# EasyEDA Pro project PCB_Preamp_5.eprj

# Schematic Preamp
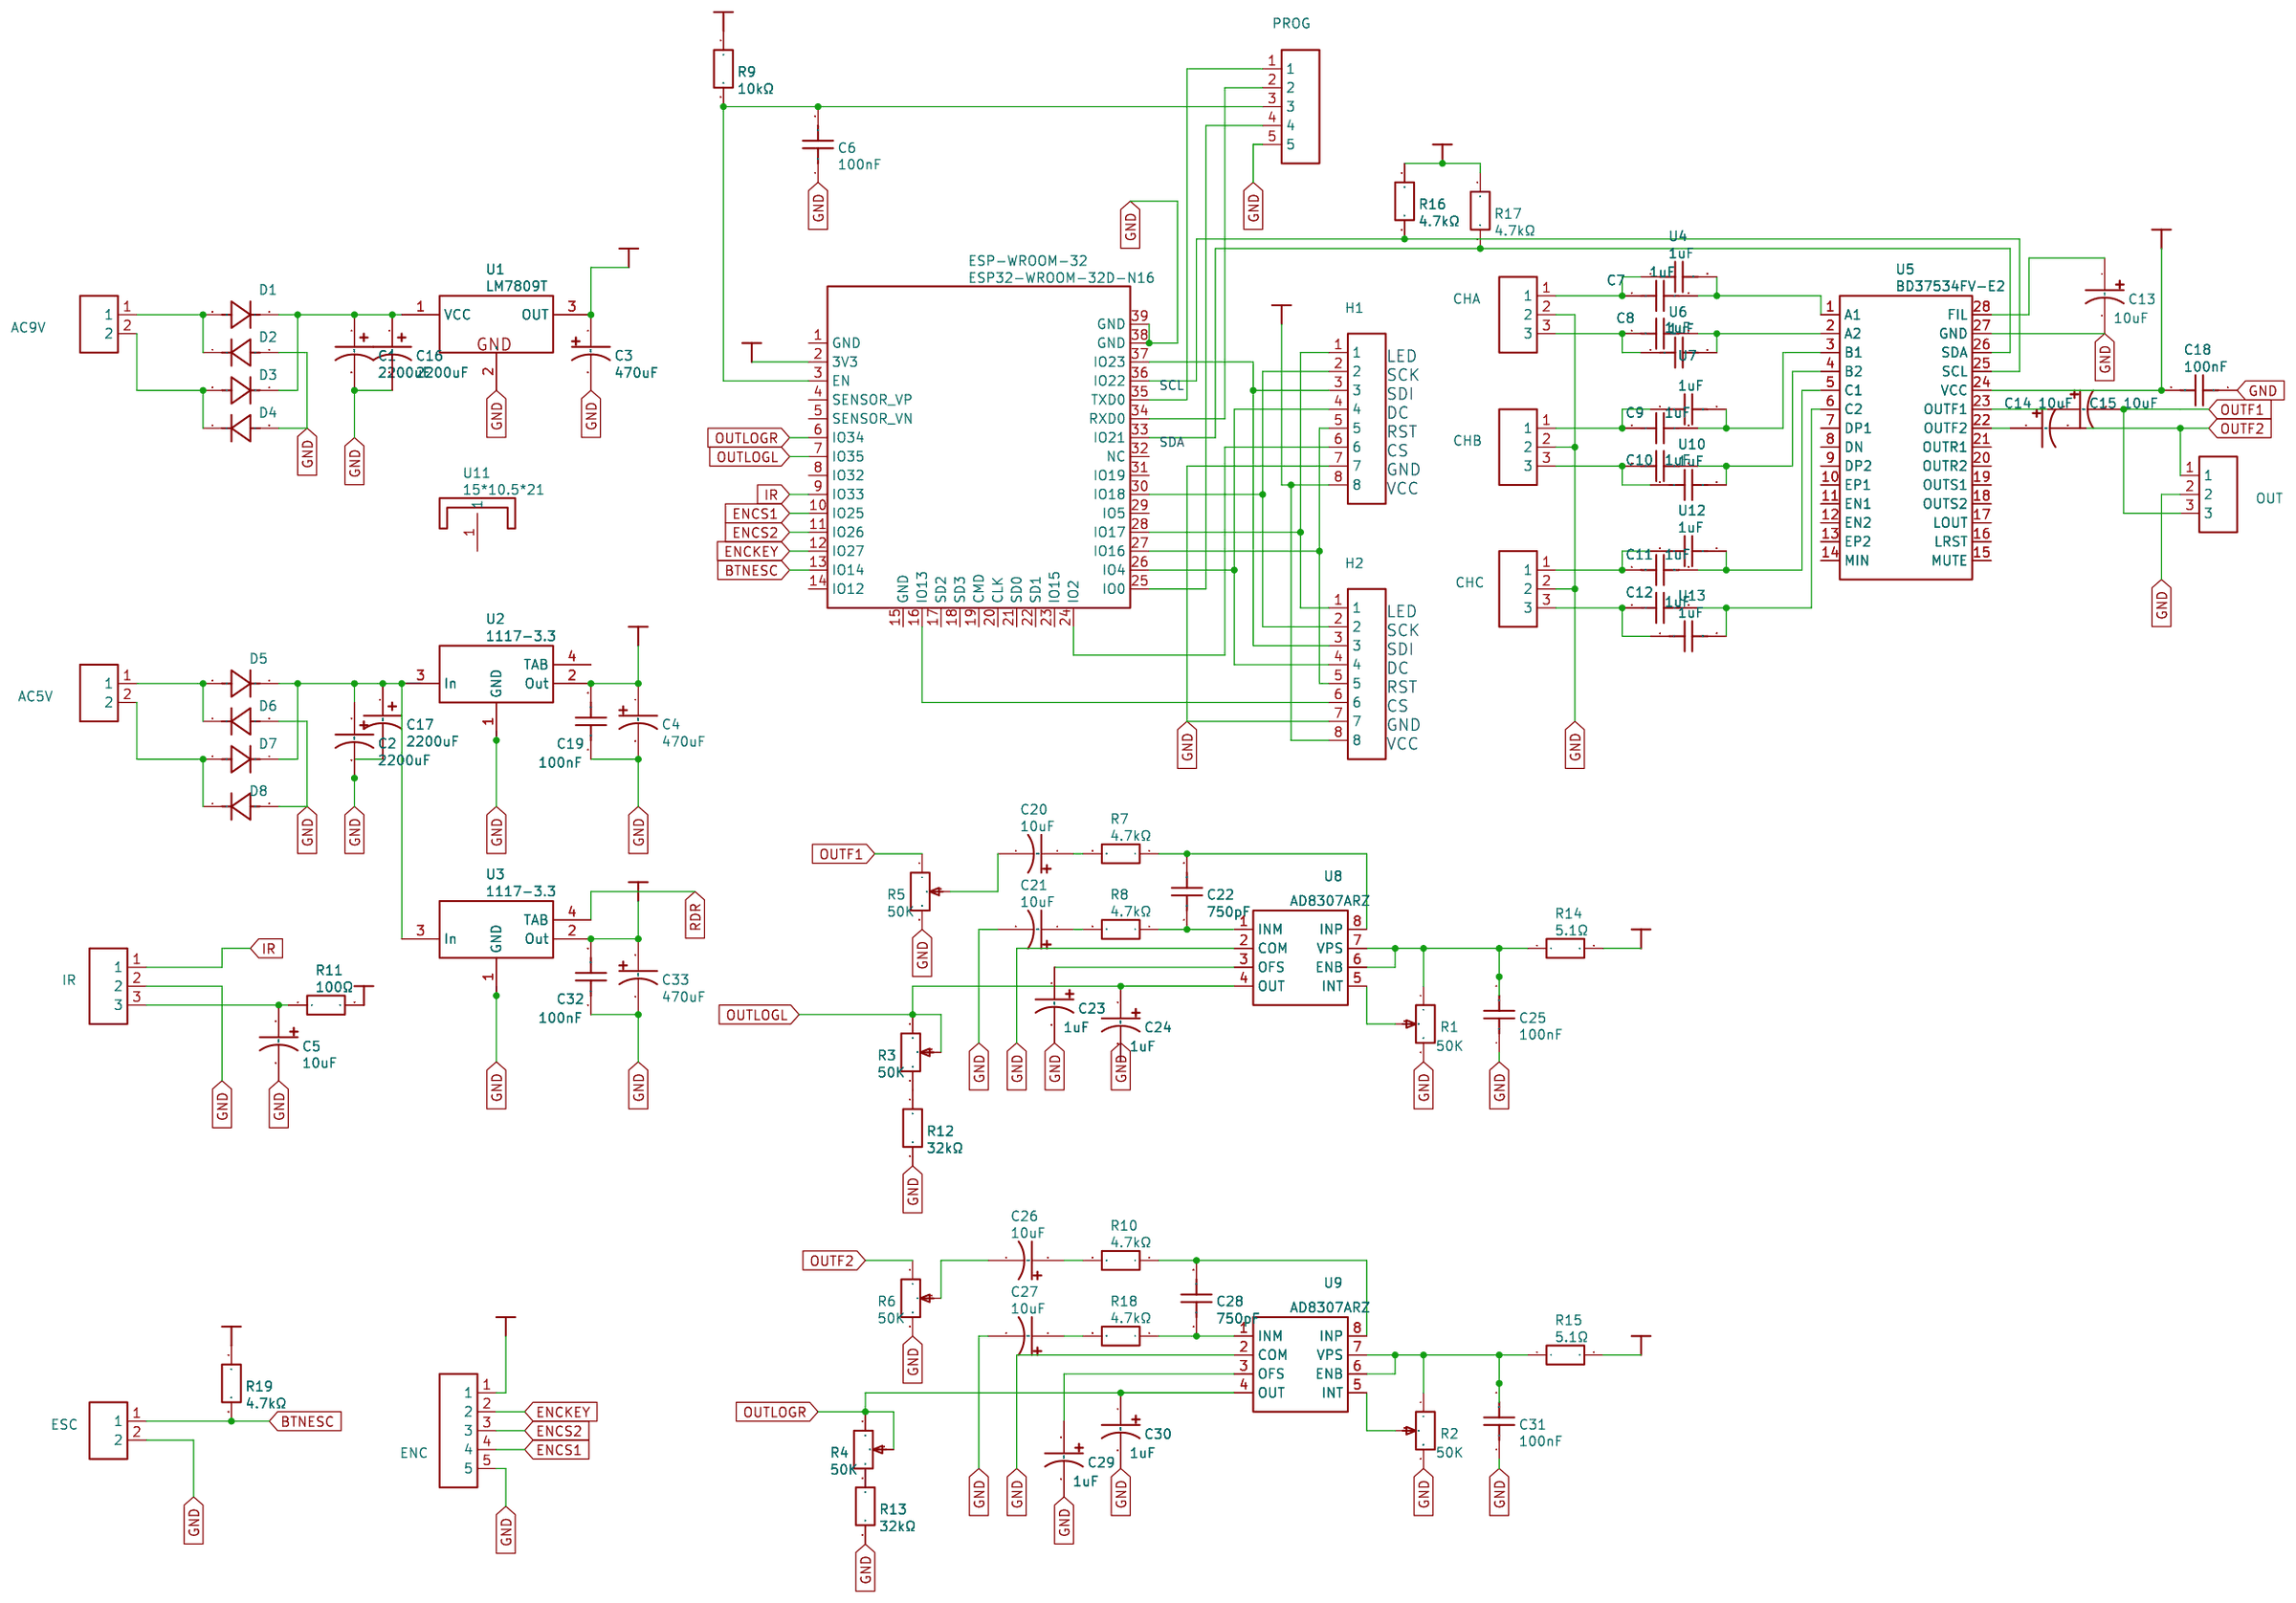
[diagram p0: schematic sheet]

## Parts
AC5V  DB126V-5.0-2P  [CONN-TH_2P-P5.00_L7.8-W10.0]
AC9V  DB126V-5.0-2P  [CONN-TH_2P-P5.00_L7.8-W10.0]
C1  2200uF  [CAP-TH_BD12.5-P5.00-D0.6-FD]
C2  2200uF  [CAP-TH_BD12.5-P5.00-D0.6-FD]
C3  470uF  [CAP-TH_BD8.0-P3.50-D0.6-FD]
C4  470uF  [CAP-TH_BD8.0-P3.50-D0.6-FD]
C5  10uF  [CAP-TH_BD5.0-P2.00-D0.5-FD]
C6  100nF  [CAP-TH_L7.2-W2.5-P5.00-D0.6]
C7  1uF  [CAP-TH_L7.0-W5.0-P5.00-D1.2]
C8  1uF  [CAP-TH_L7.0-W5.0-P5.00-D1.2]
C9  1uF  [CAP-TH_L7.0-W5.0-P5.00-D1.2]
C10  1uF  [CAP-TH_L7.0-W5.0-P5.00-D1.2]
C11  1uF  [CAP-TH_L7.0-W5.0-P5.00-D1.2]
C12  1uF  [CAP-TH_L7.0-W5.0-P5.00-D1.2]
C13  10uF  [CAP-TH_BD5.0-P2.00-D0.5-FD]
C14  10uF  [CAP-TH_BD5.0-P2.00-D0.5-FD]
C15  10uF  [CAP-TH_BD5.0-P2.00-D0.5-FD]
C16  2200uF  [CAP-TH_BD12.5-P5.00-D0.6-FD]
C17  2200uF  [CAP-TH_BD12.5-P5.00-D0.6-FD]
C18  100nF  [CAP-TH_L7.2-W2.5-P5.00-D0.6]
C19  100nF  [CAP-TH_L7.2-W2.5-P5.00-D0.6]
C20  10uF  [CAP-TH_BD5.0-P2.00-D0.5-FD]
C21  10uF  [CAP-TH_BD5.0-P2.00-D0.5-FD]
C22  750pF  [CAP-TH_L5.0-W2.5-P5.08-D0.7]
C23  1uF  [CAP-TH_BD5.0-P2.00-D0.5-FD]
C24  1uF  [CAP-TH_BD5.0-P2.00-D0.5-FD]
C25  100nF  [CAP-TH_L7.2-W2.5-P5.00-D0.6]
C26  10uF  [CAP-TH_BD5.0-P2.00-D0.5-FD]
C27  10uF  [CAP-TH_BD5.0-P2.00-D0.5-FD]
C28  750pF  [CAP-TH_L5.0-W2.5-P5.08-D0.7]
C29  1uF  [CAP-TH_BD5.0-P2.00-D0.5-FD]
C30  1uF  [CAP-TH_BD5.0-P2.00-D0.5-FD]
C31  100nF  [CAP-TH_L7.2-W2.5-P5.00-D0.6]
C32  100nF  [CAP-TH_L7.2-W2.5-P5.00-D0.6]
C33  470uF  [CAP-TH_BD8.0-P3.50-D0.6-FD]
CHA  ZX-HA2.54-3PZZ  [CONN-TH_XH-3A]
CHB  ZX-HA2.54-3PZZ  [CONN-TH_XH-3A]
CHC  ZX-HA2.54-3PZZ  [CONN-TH_XH-3A]
D1  S1D_C840837  [SMA_L4.3-W2.6-LS5.0-RD]
D2  S1D_C840837  [SMA_L4.3-W2.6-LS5.0-RD]
D3  S1D_C840837  [SMA_L4.3-W2.6-LS5.0-RD]
D4  S1D_C840837  [SMA_L4.3-W2.6-LS5.0-RD]
D5  S1D_C840837  [SMA_L4.3-W2.6-LS5.0-RD]
D6  S1D_C840837  [SMA_L4.3-W2.6-LS5.0-RD]
D7  S1D_C840837  [SMA_L4.3-W2.6-LS5.0-RD]
D8  S1D_C840837  [SMA_L4.3-W2.6-LS5.0-RD]
ENC  HC-XH-5A-G  [CONN-TH_5P-P2.50_HC-XH-5A-G]
ESC  XH-D-2A  [CONN-TH_XH-2A]
ESP-WROOM-32  ESP32-WROOM-32D-N16  [WIFIM-SMD_ESP32-WROOM-32D]
H1  61300811121  [HDR-TH_8P-P2.54-V-M]
H2  61300811121  [HDR-TH_8P-P2.54-V-M]
IR  ZX-HA2.54-3PZZ  [CONN-TH_XH-3A]
OUT  ZX-HA2.54-3PZZ  [CONN-TH_XH-3A]
PROG  HC-PZ254-11.5L-1X5PZ  [HDR-TH_5P-P2.54-V-M]
R1  50K  [RES-ADJ-SMD_RM065-V1]
R2  50K  [RES-ADJ-SMD_RM065-V1]
R3  50K  [RES-ADJ-SMD_RM065-V1]
R4  50K  [RES-ADJ-SMD_RM065-V1]
R5  50K  [RES-ADJ-SMD_RM065-V1]
R6  50K  [RES-ADJ-SMD_RM065-V1]
R7  4.7kΩ  [R1206]
R8  4.7kΩ  [R1206]
R9  10kΩ  [R1206]
R10  4.7kΩ  [R1206]
R11  100Ω  [R1206]
R12  32kΩ  [R1206]
R13  32kΩ  [R1206]
R14  5.1Ω  [R1206]
R15  5.1Ω  [R1206]
R16  4.7kΩ  [R1206]
R17  4.7kΩ  [R1206]
R18  4.7kΩ  [R1206]
R19  4.7kΩ  [R1206]
U1  LM7809T  [TO-220-3_L10.0-W4.5-P2.54-L]
U2  1117-3.3  [SOT-223-3_L6.4-W3.5-P2.30-LS7.0-BR]
U3  1117-3.3  [SOT-223-3_L6.4-W3.5-P2.30-LS7.0-BR]
U4  1uF  [CAP-TH_L13.0-W6.0-P10.00-D0.6]
U5  BD37534FV-E2  [SSOP-28_L10.4-W5.6-P0.65-LS7.6-BL]
U6  1uF  [CAP-TH_L13.0-W6.0-P10.00-D0.6]
U7  1uF  [CAP-TH_L13.0-W6.0-P10.00-D0.6]
U8  AD8307ARZ  [SOIC-8_L4.9-W3.9-P1.27-LS6.0-BL]
U9  AD8307ARZ  [SOIC-8_L4.9-W3.9-P1.27-LS6.0-BL]
U10  1uF  [CAP-TH_L13.0-W6.0-P10.00-D0.6]
U11  15*10.5*21  [SINK-TH_L15.0-W10.5-H21.0]
U12  1uF  [CAP-TH_L13.0-W6.0-P10.00-D0.6]
U13  1uF  [CAP-TH_L13.0-W6.0-P10.00-D0.6]

## Library data of the parts
AC5V AC9V = DB126V-5.0-2P: Supplier: LCSC; Supplier Part: C395849; Manufacturer: DORABO(地博电气); Manufacturer Part: DB126V-5.0-2P-GN-P; JLCPCB Part Class: Extended Part; Contributor: LCSC; spicePre: U
C1 C2 C16 C17 = 2200uF: Supplier: LCSC; Supplier Part: C2843234; Manufacturer: rubycon(红宝石); Manufacturer Part: 16YXG2200MLLCCE12.5X25; Contributor: lcsc; nameAlias: Value; spicePre: U; spiceSymbolName: 16YXG2200MLLCCE12.5X25
C3 C4 C33 = 470uF: Supplier: LCSC; Supplier Part: C394256; Manufacturer: HEAO(和澳); Manufacturer Part: EHRL474M016F12BC; JLCPCB Part Class: Extended Part; nameAlias: Value; Contributor: LCSC; spicePre: C; spiceSymbolName: EHRL474M016F12BC
C5 C13-C15 C20 C21 C26 C27 = 10uF: Supplier: LCSC; Supplier Part: C432384; Manufacturer: rubycon(红宝石); Manufacturer Part: 35ZLJ47M5X11; JLCPCB Part Class: Extended Part; Contributor: lcsc; nameAlias: Value; spicePre: U; spiceSymbolName: 35ZLJ47M5X11
C6 C18 C19 C25 C31 C32 = 100nF: Supplier: LCSC; Supplier Part: C3000845; Manufacturer: VISHAY(威世); Manufacturer Part: BFC237011104; JLCPCB Part Class: Extended Part; nameAlias: Value; Contributor: lcsc; spicePre: U; spiceSymbolName: BFC237011104
C7-C12 = 1uF: Supplier: LCSC; Supplier Part: C2840382; Manufacturer: faratronic(厦门法拉); Manufacturer Part: C241J105J2SC000; JLCPCB Part Class: Extended Part; Contributor: LCSC; nameAlias: Value; spicePre: U; spiceSymbolName: C241J105J2SC000
C22 C28 = 750pF: Supplier: LCSC; Supplier Part: C19512466; Manufacturer: muRata(村田); Manufacturer Part: RPE5C1H681J2S1A03A; JLCPCB Part Class: Extended Part; nameAlias: Value; Contributor: lcsc; spicePre: U; spiceSymbolName: RPE5C1H681J2S1A03A
C23 C24 C29 C30 = 1uF: Supplier: LCSC; Supplier Part: C432384; Manufacturer: rubycon(红宝石); Manufacturer Part: 35ZLJ47M5X11; JLCPCB Part Class: Extended Part; Contributor: lcsc; nameAlias: Value; spicePre: U; spiceSymbolName: 35ZLJ47M5X11
CHA CHB CHC IR OUT = ZX-HA2.54-3PZZ: Supplier: LCSC; Supplier Part: C7429615; Manufacturer: Megastar(兆星); JLCPCB Part Class: Extended Part; Contributor: lcsc; spicePre: U
D1-D8 = S1D_C840837: Supplier: LCSC; Supplier Part: C840837; Manufacturer: MDD(辰达半导体); Manufacturer Part: S1D; JLCPCB Part Class: Extended Part; Contributor: LCSC; spicePre: D
ENC = HC-XH-5A-G: Supplier: LCSC; Supplier Part: C5341204; Manufacturer: HCTL(华灿天禄); JLCPCB Part Class: Extended Part; Contributor: lcsc; spicePre: C
ESC = XH-D-2A: Supplier: LCSC; Supplier Part: C5160911; Manufacturer: DEALON(德艺隆); JLCPCB Part Class: Extended Part; Contributor: lcsc; spicePre: C
ESP-WROOM-32 = ESP32-WROOM-32D-N16: Supplier: LCSC; Supplier Part: C2973676; Manufacturer: null; Manufacturer Part: ESP32-WROOM-32D-N16-被合并; JLCPCB Part Class: Extended Part; Contributor: lcsc; spicePre: U
H1 H2 = 61300811121: Supplier: LCSC; Supplier Part: C6400764; Manufacturer: Wurth(伍尔特); JLCPCB Part Class: Extended Part; Contributor: lcsc; spicePre: H
PROG = HC-PZ254-11.5L-1X5PZ: Supplier: LCSC; Supplier Part: C27985190; Manufacturer: HC(虹成电子); Manufacturer Part: HC-PZ254-11.5L-1x5PZ; Contributor: lcsc; spicePre: C
R1-R6 = 50K: Supplier: LCSC; Manufacturer: null; Manufacturer Part: 蓝白可调电阻 RM065-V1-102; Supplier Part: C53566; JLCPCB Part Class: Extended Part; nameAlias: Resistance(Ohms); spicePre: R; spiceSymbolName: RM065-V1-102
R7 R8 R10 R16-R19 = 4.7kΩ: Supplier: LCSC; Supplier Part: C2897062; Manufacturer: VO(翔胜); Manufacturer Part: CR1/8W-4K7±5%-ST26; JLCPCB Part Class: Extended Part; Contributor: lcsc; nameAlias: Value; spicePre: U; spiceSymbolName: CR1/8W-4K7±5%-ST26
R9 = 10kΩ: Supplier: LCSC; Supplier Part: C2897062; Manufacturer: VO(翔胜); Manufacturer Part: CR1/8W-4K7±5%-ST26; JLCPCB Part Class: Extended Part; Contributor: lcsc; nameAlias: Value; spicePre: U; spiceSymbolName: CR1/8W-4K7±5%-ST26
R11 = 100Ω: Supplier: LCSC; Supplier Part: C2897062; Manufacturer: VO(翔胜); Manufacturer Part: CR1/8W-4K7±5%-ST26; JLCPCB Part Class: Extended Part; Contributor: lcsc; nameAlias: Value; spicePre: U; spiceSymbolName: CR1/8W-4K7±5%-ST26
R12 R13 = 32kΩ: Supplier: LCSC; Supplier Part: C2897062; Manufacturer: VO(翔胜); Manufacturer Part: CR1/8W-4K7±5%-ST26; JLCPCB Part Class: Extended Part; Contributor: lcsc; nameAlias: Value; spicePre: U; spiceSymbolName: CR1/8W-4K7±5%-ST26
R14 R15 = 5.1Ω: Supplier: LCSC; Supplier Part: C2897062; Manufacturer: VO(翔胜); Manufacturer Part: CR1/8W-4K7±5%-ST26; JLCPCB Part Class: Extended Part; Contributor: lcsc; nameAlias: Value; spicePre: U; spiceSymbolName: CR1/8W-4K7±5%-ST26
U1 = LM7809T: Supplier: LCSC; Supplier Part: C507141; Manufacturer: HGSEMI(华冠); JLCPCB Part Class: Extended Part; Contributor: LCSC; spicePre: U
U2 U3 = 1117-3.3: Supplier: LCSC; Supplier Part: C5125088; Manufacturer: IDCHIP(英锐芯); JLCPCB Part Class: Extended Part; Contributor: lcsc; spicePre: U
U4 U6 U7 U10 U12 U13 = 1uF: Supplier: LCSC; Supplier Part: C515228; Manufacturer: TDK; Manufacturer Part: B32521C1105J; JLCPCB Part Class: Extended Part; Contributor: lcsc; nameAlias: Value; spicePre: U; spiceSymbolName: B32521C1105J
U5 = BD37534FV-E2: Supplier: LCSC; Supplier Part: C111704; Manufacturer: ROHM(罗姆); JLCPCB Part Class: Extended Part; Contributor: lcsc; spicePre: U
U8 U9 = AD8307ARZ: Supplier: LCSC; Supplier Part: C578685; Manufacturer: ADI(亚德诺)/LINEAR(凌特); JLCPCB Part Class: Extended Part; Contributor: LCSC; spicePre: U
U11 = 15*10.5*21: Supplier: LCSC; Supplier Part: C4649; Manufacturer: XSD(鑫顺达); Manufacturer Part: 15.5*10.5*21; JLCPCB Part Class: Extended Part; Contributor: LCSC; spicePre: U

## Nets
+3V3: C4.1 C19.2 R14.2 R15.2 U2.2(Out)
+3V3D: C32.2 C33.1 ENC.1 ESP-WROOM-32.2(3V3) H1.8 H2.8 R9.1 R11.2 R16.1 R17.1 R19.1 U3.2(Out)
+9V: C3.1 C18.2 U1.3(OUT) U5.24(VCC)
GND: C1.2 C2.2 C3.2 C4.2 C5.2 C6.1 C13.2 C16.2 C17.2 C18.1 C19.1 C21.2 C23.2 C24.2 C25.1 C27.2 C29.2 C30.2 C31.1 C32.1 C33.2 CHA.2 CHB.2 CHC.2 D2.2(A) D4.2(A) D6.2(A) D8.2(A) ENC.5 ESC.2 ESP-WROOM-32.38(GND) ESP-WROOM-32.39(GND) H1.7 H2.7 IR.2 OUT.2 PROG.5 R1.3 R2.3 R5.3 R6.3 R12.2 R13.2 U1.2(GND) U2.1(GND) U3.1(GND) U5.27(GND) U8.2(COM) U9.2(COM)
BTNESC: ESC.1 ESP-WROOM-32.13(IO14) R19.2
ENCKEY: ENC.2 ESP-WROOM-32.12(IO27)
ENCS1: ENC.4 ESP-WROOM-32.10(IO25)
ENCS2: ENC.3 ESP-WROOM-32.11(IO26)
IR: ESP-WROOM-32.9(IO33) IR.1
OUTF1: C15.2 OUT.3 R5.1
OUTF2: C14.2 OUT.1 R6.1
OUTLOGL: C24.1 ESP-WROOM-32.7(IO35) R3.1 R3.2 U8.4(OUT)
OUTLOGR: C30.1 ESP-WROOM-32.6(IO34) R4.1 R4.2 U9.4(OUT)
RDR: U3.4(TAB)
$1N1: AC9V.1 D1.2(A) D2.1(K)
$1N2: AC9V.2 D3.2(A) D4.1(K)
$1N4: C1.1 C16.1 D1.1(K) D3.1(K) U1.1(VCC)
$1N7: ESP-WROOM-32.24(IO2) H1.6
$1N8: ESP-WROOM-32.27(IO16) H1.5 H2.5
$1N9: ESP-WROOM-32.26(IO4) H1.4 H2.4
$1N10: ESP-WROOM-32.37(IO23) H1.3 H2.3
$1N11: ESP-WROOM-32.30(IO18) H1.2 H2.2
$1N12: ESP-WROOM-32.28(IO17) H1.1 H2.1
$1N13: ESP-WROOM-32.36(IO22) R16.2 U5.25(SCL)
$1N14: ESP-WROOM-32.33(IO21) R17.2 U5.26(SDA)
$1N15: C7.2 U4.2 U5.1(A1)
$1N16: C8.2 U5.2(A2) U6.2
$1N17: C9.2 U5.3(B1) U7.2
$1N18: C10.2 U5.4(B2) U10.2
$1N19: C11.2 U5.5(C1) U12.2
$1N20: C12.2 U5.6(C2) U13.2
$1N22: C13.1 U5.28(FIL)
$1N24: C12.1 CHC.3 U13.1
$1N25: C11.1 CHC.1 U12.1
$1N26: C10.1 CHB.3 U10.1
$1N27: C9.1 CHB.1 U7.1
$1N28: C8.1 CHA.3 U6.1
$1N29: C7.1 CHA.1 U4.1
$1N32: C5.1 IR.3 R11.1
$1N44: C25.2 R1.1 R14.1 U8.6(ENB) U8.7(VPS)
$1N46: R1.2 U8.5(INT)
$1N51: C23.1 U8.3(OFS)
$1N54: C29.1 U9.3(OFS)
$1N56: C31.2 R2.1 R15.1 U9.6(ENB) U9.7(VPS)
$1N60: R2.2 U9.5(INT)
$1N67: C20.2 R5.2
$1N69: C26.2 R6.2
$1N71: ESP-WROOM-32.16(IO13) H2.6
$1N81: C6.2 ESP-WROOM-32.3(EN) PROG.3 R9.2
$1N82: ESP-WROOM-32.25(IO0) PROG.4
$1N83: ESP-WROOM-32.35(TXD0) PROG.1
$1N84: ESP-WROOM-32.34(RXD0) PROG.2
$1N85: C2.1 C17.1 D5.1(K) D7.1(K) U2.3(In) U3.3(In)
$1N87: AC5V.1 D5.2(A) D6.1(K)
$1N88: AC5V.2 D7.2(A) D8.1(K)
$1N99: C20.1 R7.2
$1N100: C22.2 R7.1 U8.8(INP)
$1N101: C21.1 R8.2
$1N102: C22.1 R8.1 U8.1(INM)
$1N103: C26.1 R10.2
$1N104: C28.2 R10.1 U9.8(INP)
$1N105: C27.1 R18.2
$1N106: C28.1 R18.1 U9.1(INM)
$1N107: R4.3 R13.1
$1N111: C15.1 U5.23(OUTF1)
$1N112: C14.1 U5.22(OUTF2)
$1N2022: R3.3 R12.1

Not connected (* = marked no-connect by the designer): ESP-WROOM-32 1(GND) 4(SENSOR_VP) 5(SENSOR_VN) 8(IO32) 14(IO12) 15(GND) 17(SD2) 18(SD3) 19(CMD) 20(CLK) 21(SD0) 22(SD1) 23(IO15) 29(IO5) 31(IO19) 32(NC); U2 4(TAB); U5 7(DP1) 8(DN) 9(DP2) 10(EP1) 11(EN1) 12(EN2) 13(EP2) 14(MIN) 15(MUTE) 16(LRST) 17(LOUT) 18(OUTS2) 19(OUTS1) 20(OUTR2) 21(OUTR1); U11 1

## Notes on the sheet
- LED
- SCL
- SCK
- SDI
- DC
- RST
- SDA
- CS
- GND
- VCC
- LED
- SCK
- SDI
- DC
- CS
- RST
- GND
- VCC

# Board PCB_Preamp_5
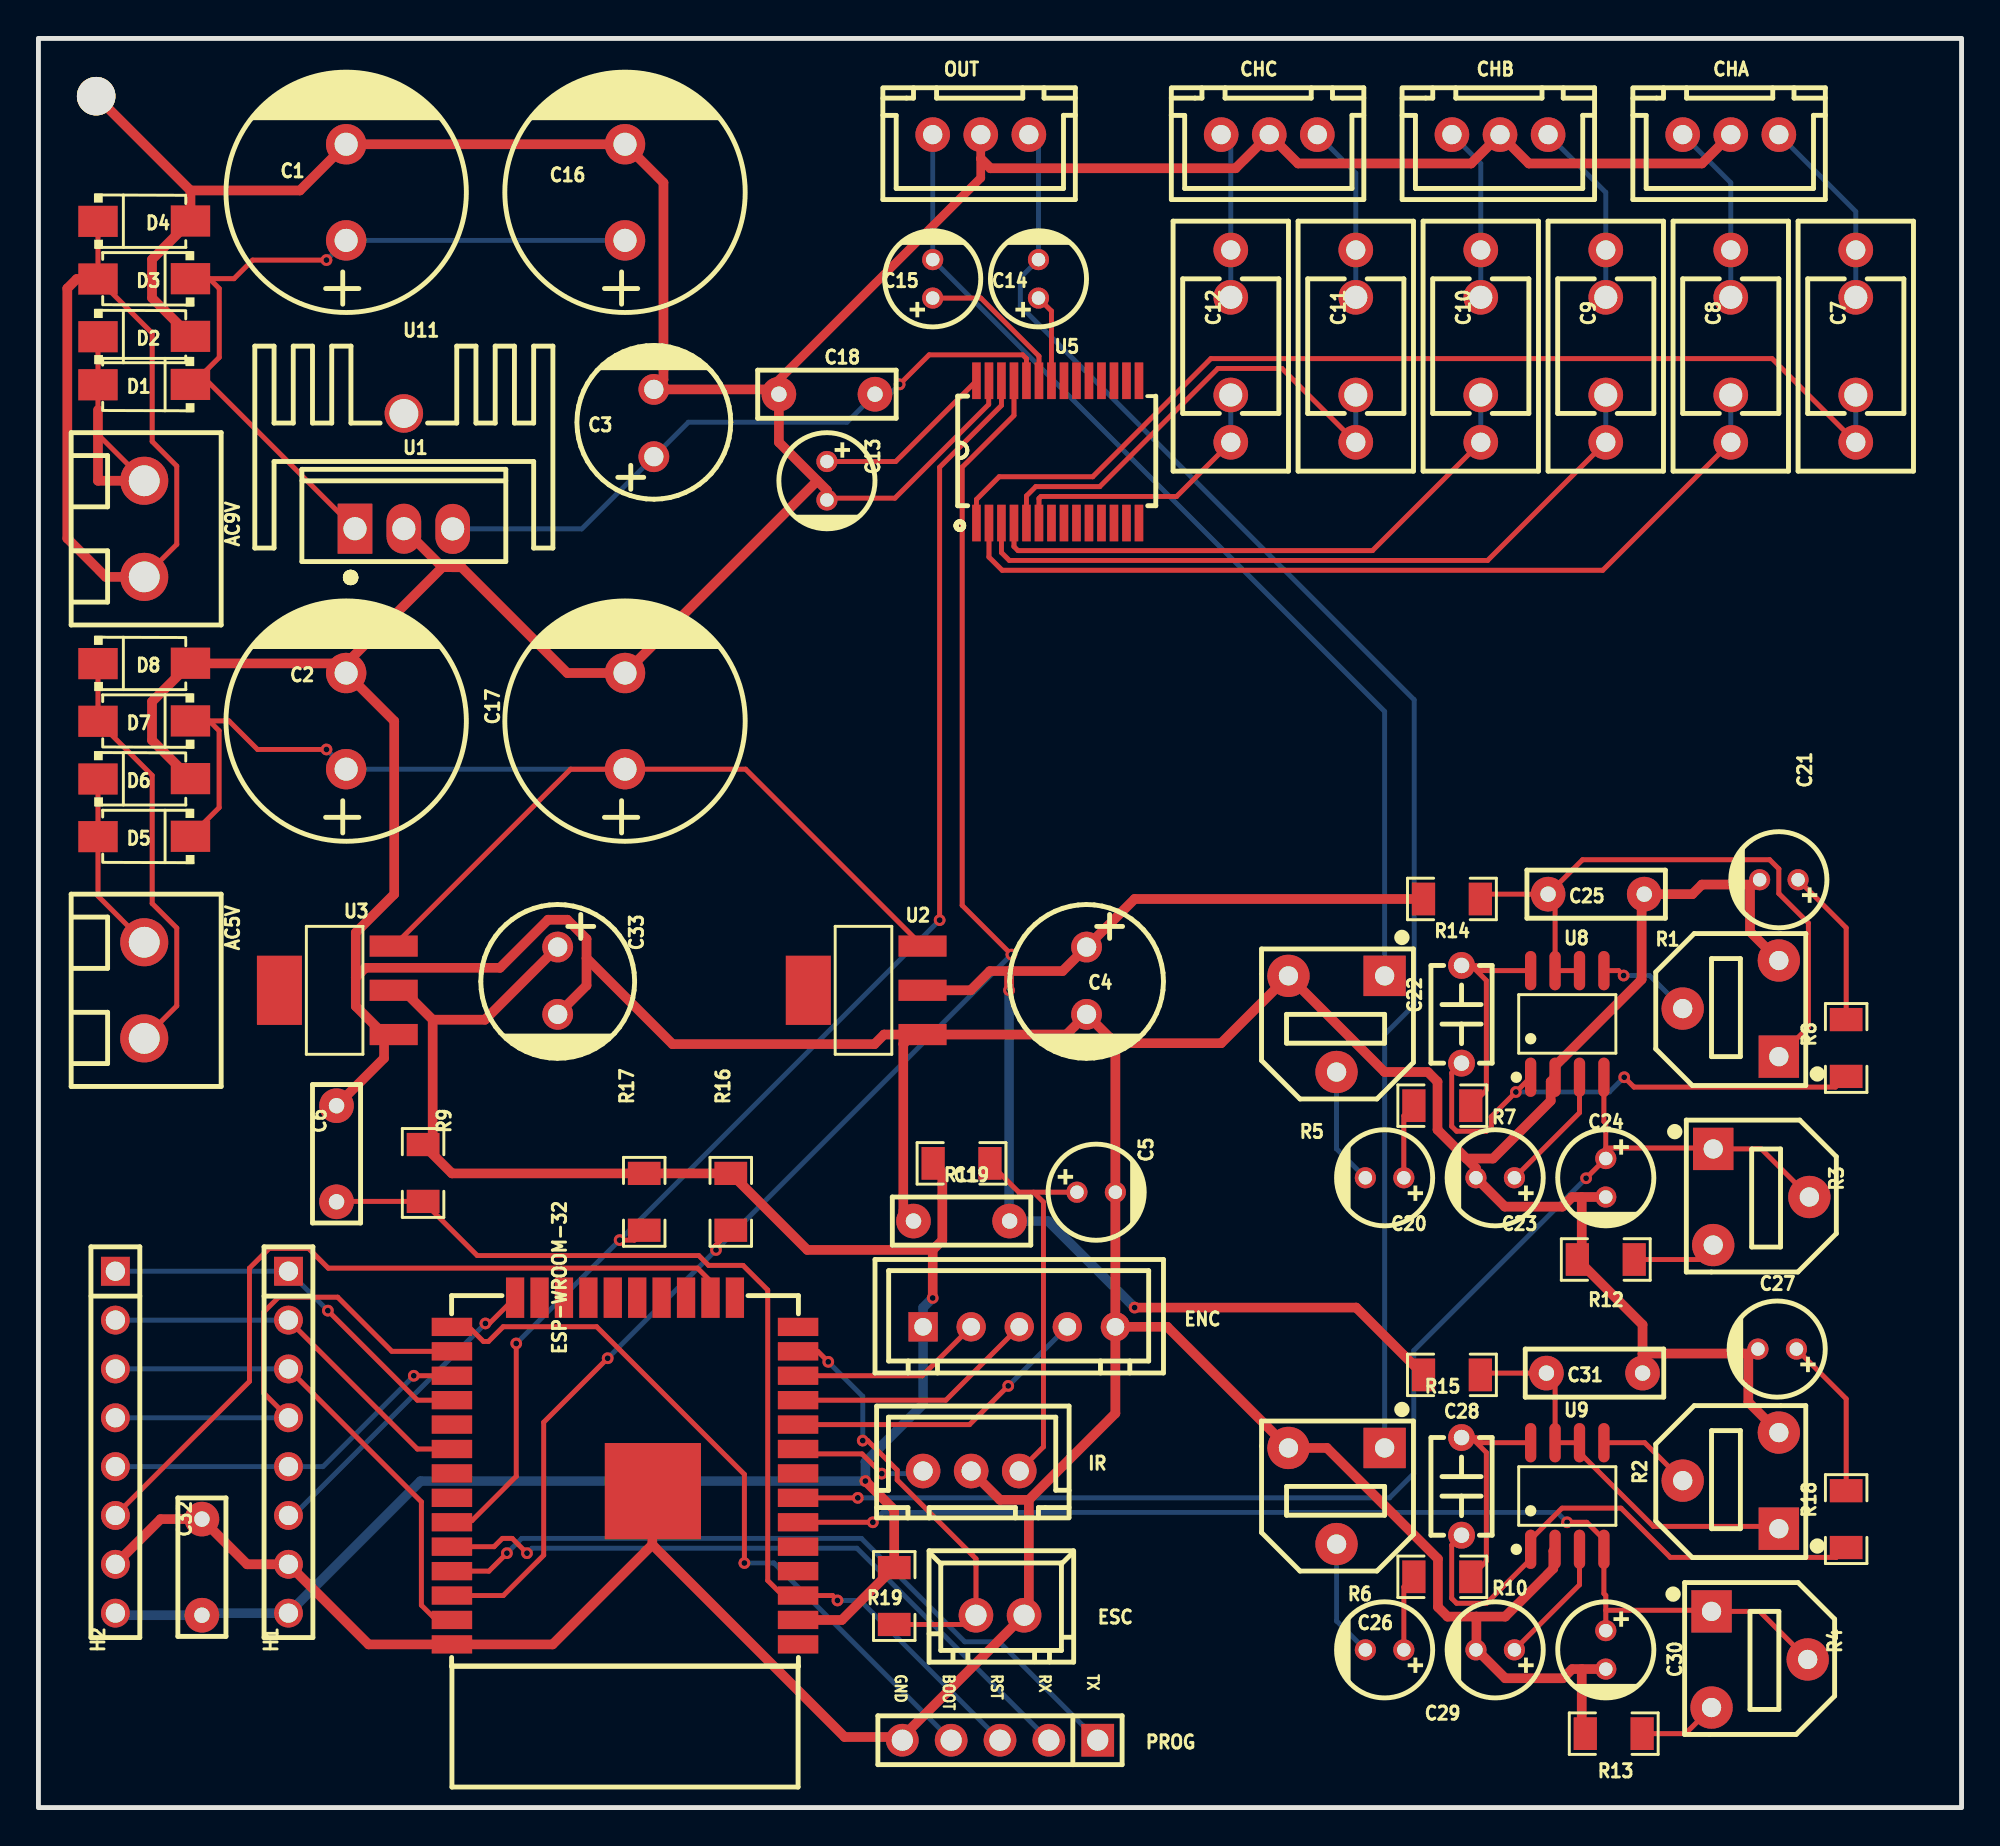
[diagram p1: board, top side]
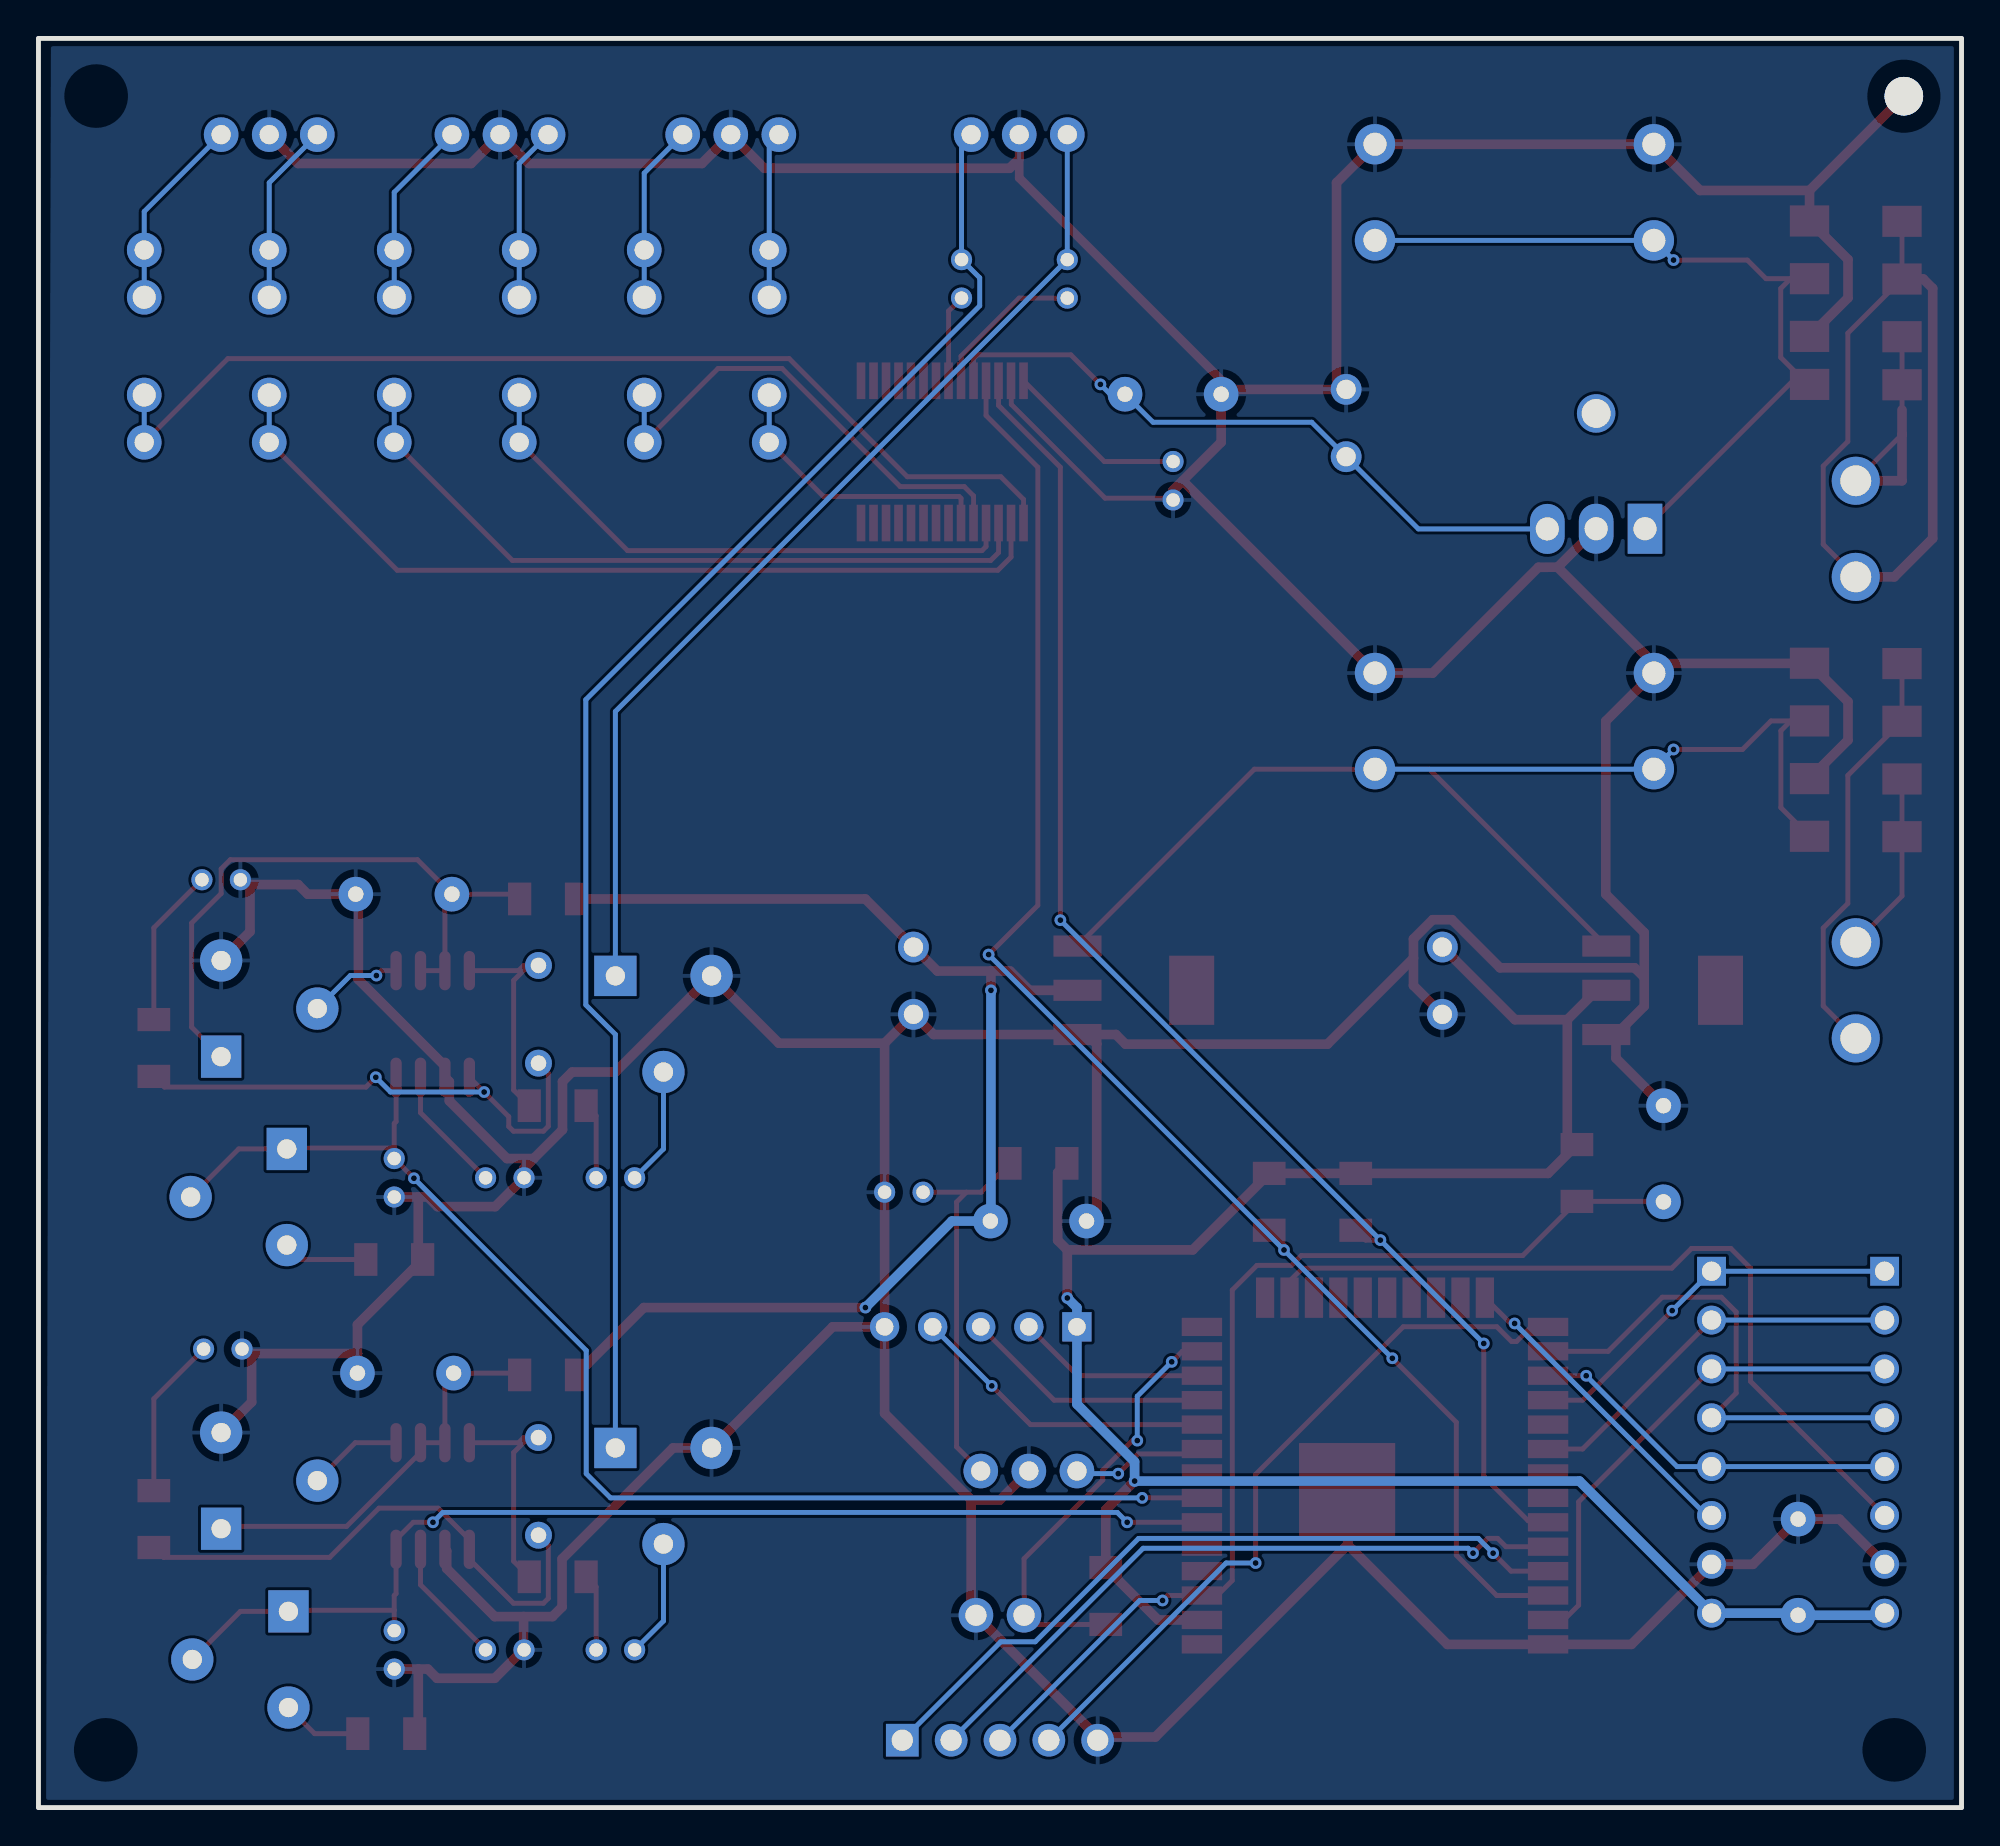
[diagram p2: board, bottom side, seen from below]

Outline 100 x 92 mm; copper layers: Top Layer, Bottom Layer. Coordinates in mm from the lower left corner of the outline.
Outline path: 0,92 100,92 100,0 0,0 0,92
Stack: Top Layer 0.035mm / Dielectric1 1.51mm FR4 er 4.5 / Bottom Layer 0.035mm

## Design rules (mm)
template: User Custom Config
spacing Default (default): track to track 0.25, other pairs 0 to 0.25
spacing 0,5mm: track to track 0.25, other pairs 0 to 0.25
spacing 1mm: track to track 0.512, other pairs 0 to 0.512
spacing 9V: track to track 0.25, other pairs 0 to 0.25
track width Default (default): min 0.256, default 0.256, max 25.4
track width 0,5mm: min 0.5, default 0.5, max 25.4
track width 1mm: min 1, default 1, max 25.4
track width 9V: min 0.35, default 0.35, max 25.4
differential pair differentialPair (default): width min 0.127, default 0.254, max 2.54; gap min 0.152, default 0.152
via Default (default): diameter min 0.61, default 0.61, max 100.025; hole min 0.305, default 0.305, max 59.995
via 0,5mm: diameter min 0.61, default 0.61, max 100.025; hole min 0.305, default 0.305, max 59.995
via 1mm: diameter min 0.61, default 0.61, max 100.025; hole min 0.305, default 0.305, max 59.995
via 9V: diameter min 0.61, default 0.61, max 100.025; hole min 0.305, default 0.305, max 59.995
net GND uses 0,5mm
net +3V3D uses 0,5mm
net +3V3 uses 0,5mm
pour e152 uses gge100100

## Placement (name value [footprint] x y rotation side)
AC5V  DB126V-5.0-2P  [CONN-TH_2P-P5.00_L7.8-W10.0]  5.5 42.5 270 top
AC9V  DB126V-5.0-2P  [CONN-TH_2P-P5.00_L7.8-W10.0]  5.5 66.5 270 top
C1  2200uF  [CAP-TH_BD12.5-P5.00-D0.6-FD]  16 84 90 top
C2  2200uF  [CAP-TH_BD12.5-P5.00-D0.6-FD]  16 56.5 90 top
C3  470uF  [CAP-TH_BD8.0-P3.50-D0.6-FD]  32 72 90 top
C4  470uF  [CAP-TH_BD8.0-P3.50-D0.6-FD]  54.5 43 270 top
C5  10uF  [CAP-TH_BD5.0-P2.00-D0.5-FD]  55 32 0 top
C6  100nF  [CAP-TH_L7.2-W2.5-P5.00-D0.6]  15.5 34 270 top
C7  1uF  [CAP-TH_L7.0-W5.0-P5.00-D1.2]  94.5 76 270 top
C8  1uF  [CAP-TH_L7.0-W5.0-P5.00-D1.2]  88 76 270 top
C9  1uF  [CAP-TH_L7.0-W5.0-P5.00-D1.2]  81.5 76 270 top
C10  1uF  [CAP-TH_L7.0-W5.0-P5.00-D1.2]  75 76 270 top
C11  1uF  [CAP-TH_L7.0-W5.0-P5.00-D1.2]  68.5 76 270 top
C12  1uF  [CAP-TH_L7.0-W5.0-P5.00-D1.2]  62 76 270 top
C13  10uF  [CAP-TH_BD5.0-P2.00-D0.5-FD]  41 69 270 top
C14  10uF  [CAP-TH_BD5.0-P2.00-D0.5-FD]  52 79.5 90 top
C15  10uF  [CAP-TH_BD5.0-P2.00-D0.5-FD]  46.5 79.5 90 top
C16  2200uF  [CAP-TH_BD12.5-P5.00-D0.6-FD]  30.5 84 90 top
C17  2200uF  [CAP-TH_BD12.5-P5.00-D0.6-FD]  30.5 56.5 90 top
C18  100nF  [CAP-TH_L7.2-W2.5-P5.00-D0.6]  41 73.5 0 top
C19  100nF  [CAP-TH_L7.2-W2.5-P5.00-D0.6]  48 30.5 0 top
C20  10uF  [CAP-TH_BD5.0-P2.00-D0.5-FD]  70 32.75 180 top
C21  10uF  [CAP-TH_BD5.0-P2.00-D0.5-FD]  90.5 48.25 180 top
C22  750pF  [CAP-TH_L5.0-W2.5-P5.08-D0.7]  74 41.25 90 top
C23  1uF  [CAP-TH_BD5.0-P2.00-D0.5-FD]  75.75 32.75 180 top
C24  1uF  [CAP-TH_BD5.0-P2.00-D0.5-FD]  81.5 32.75 270 top
C25  100nF  [CAP-TH_L7.2-W2.5-P5.00-D0.6]  81 47.5 180 top
C26  10uF  [CAP-TH_BD5.0-P2.00-D0.5-FD]  70 8.2 180 top
C27  10uF  [CAP-TH_BD5.0-P2.00-D0.5-FD]  90.41 23.84 180 top
C28  750pF  [CAP-TH_L5.0-W2.5-P5.08-D0.7]  74 16.7 90 top
C29  1uF  [CAP-TH_BD5.0-P2.00-D0.5-FD]  75.75 8.2 180 top
C30  1uF  [CAP-TH_BD5.0-P2.00-D0.5-FD]  81.5 8.2 270 top
C31  100nF  [CAP-TH_L7.2-W2.5-P5.00-D0.6]  80.91 22.59 180 top
C32  100nF  [CAP-TH_L7.2-W2.5-P5.00-D0.6]  8.5 12.5 270 top
C33  470uF  [CAP-TH_BD8.0-P3.50-D0.6-FD]  27 43 270 top
CHA  ZX-HA2.54-3PZZ  [CONN-TH_XH-3A]  88 87 180 top
CHB  ZX-HA2.54-3PZZ  [CONN-TH_XH-3A]  76 87 180 top
CHC  ZX-HA2.54-3PZZ  [CONN-TH_XH-3A]  64 87 180 top
D1  S1D_C840837  [SMA_L4.3-W2.6-LS5.0-RD]  5.5 74 180 top
D2  S1D_C840837  [SMA_L4.3-W2.6-LS5.0-RD]  5.5 76.5 0 top
D3  S1D_C840837  [SMA_L4.3-W2.6-LS5.0-RD]  5.5 79.5 180 top
D4  S1D_C840837  [SMA_L4.3-W2.6-LS5.0-RD]  5.5 82.5 0 top
D5  S1D_C840837  [SMA_L4.3-W2.6-LS5.0-RD]  5.5 50.5 180 top
D6  S1D_C840837  [SMA_L4.3-W2.6-LS5.0-RD]  5.5 53.5 0 top
D7  S1D_C840837  [SMA_L4.3-W2.6-LS5.0-RD]  5.5 56.5 180 top
D8  S1D_C840837  [SMA_L4.3-W2.6-LS5.0-RD]  5.5 59.5 0 top
ENC  HC-XH-5A-G  [CONN-TH_5P-P2.50_HC-XH-5A-G]  51 25 0 top
ESC  XH-D-2A  [CONN-TH_XH-2A]  50 10 0 top
ESP-WROOM-32  ESP32-WROOM-32D-N16  [WIFIM-SMD_ESP32-WROOM-32D]  30.5 17.5 90 top
H1  61300811121  [HDR-TH_8P-P2.54-V-M]  13 19 270 top
H2  61300811121  [HDR-TH_8P-P2.54-V-M]  4 19 270 top
IR  ZX-HA2.54-3PZZ  [CONN-TH_XH-3A]  48.5 17.5 0 top
NOREF  -  [Pad_e1511]  3 89 0 top
OUT  ZX-HA2.54-3PZZ  [CONN-TH_XH-3A]  49 87 180 top
PROG  HC-PZ254-11.5L-1X5PZ  [HDR-TH_5P-P2.54-V-M]  50 3.5 180 top
R1  50K  [RES-ADJ-SMD_RM065-V1]  88 41.55 90 top
R2  50K  [RES-ADJ-SMD_RM065-V1]  88 17 90 top
R3  50K  [RES-ADJ-SMD_RM065-V1]  89.59 31.75 270 top
R4  50K  [RES-ADJ-SMD_RM065-V1]  89.5 7.7 270 top
R5  50K  [RES-ADJ-SMD_RM065-V1]  67.5 40.75 180 top
R6  50K  [RES-ADJ-SMD_RM065-V1]  67.5 16.2 180 top
R7  4.7kΩ  [R1206]  73 36.5 180 top
R8  4.7kΩ  [R1206]  94 39.5 90 top
R9  10kΩ  [R1206]  20 33 270 top
R10  4.7kΩ  [R1206]  73 12 180 top
R11  100Ω  [R1206]  48 33.5 180 top
R12  32kΩ  [R1206]  81.5 28.5 180 top
R13  32kΩ  [R1206]  81.91 3.84 180 top
R14  5.1Ω  [R1206]  73.5 47.25 180 top
R15  5.1Ω  [R1206]  73.5 22.5 180 top
R16  4.7kΩ  [R1206]  36 31.5 270 top
R17  4.7kΩ  [R1206]  31.5 31.5 270 top
R18  4.7kΩ  [R1206]  94 15 90 top
R19  4.7kΩ  [R1206]  44.5 11 270 top
U1  LM7809T  [TO-220-3_L10.0-W4.5-P2.54-L]  19 66.5 0 top
U2  1117-3.3  [SOT-223-3_L6.4-W3.5-P2.30-LS7.0-BR]  43 42.5 0 top
U3  1117-3.3  [SOT-223-3_L6.4-W3.5-P2.30-LS7.0-BR]  15.5 42.5 0 top
U4  1uF  [CAP-TH_L13.0-W6.0-P10.00-D0.6]  94.5 76 270 top
U5  BD37534FV-E2  [SSOP-28_L10.4-W5.6-P0.65-LS7.6-BL]  53 70.5 0 top
U6  1uF  [CAP-TH_L13.0-W6.0-P10.00-D0.6]  88 76 270 top
U7  1uF  [CAP-TH_L13.0-W6.0-P10.00-D0.6]  81.5 76 270 top
U8  AD8307ARZ  [SOIC-8_L4.9-W3.9-P1.27-LS6.0-BL]  79.5 40.75 0 top
U9  AD8307ARZ  [SOIC-8_L4.9-W3.9-P1.27-LS6.0-BL]  79.5 16.2 0 top
U10  1uF  [CAP-TH_L13.0-W6.0-P10.00-D0.6]  75 76 270 top
U11  15*10.5*21  [SINK-TH_L15.0-W10.5-H21.0]  19 72.5 0 top
U12  1uF  [CAP-TH_L13.0-W6.0-P10.00-D0.6]  68.5 76 270 top
U13  1uF  [CAP-TH_L13.0-W6.0-P10.00-D0.6]  62 76 270 top

## Footprints (pads in the part's own frame, mm; a bottom-side part is the same pattern mirrored in y, then rotated)
CAP-TH_BD5.0-P2.00-D0.5-FD
  round 1.1 hole 0.7: 1(-1,0) 2(1,0)
CAP-TH_BD8.0-P3.50-D0.6-FD
  round 1.6 hole 1: 1(-1.75,0) 2(1.75,0)
CAP-TH_BD12.5-P5.00-D0.6-FD
  round 2.1 hole 1.2: 1(-2.5,0) 2(2.5,0)
CAP-TH_L5.0-W2.5-P5.08-D0.7
  round 1.4 hole 0.8: 1(-2.54,0) 2(2.54,0)
CAP-TH_L7.0-W5.0-P5.00-D1.2
  round 1.8 hole 1.2: 1(-2.54,0) 2(2.54,0)
CAP-TH_L7.2-W2.5-P5.00-D0.6
  round 1.8 hole 0.8: 1(-2.499,0) 2(2.499,0)
CAP-TH_L13.0-W6.0-P10.00-D0.6
  round 1.8 hole 1: 1(-5,0) 2(5,0)
CONN-TH_2P-P5.00_L7.8-W10.0
  round 2.5 hole 1.6: 1(-2.5,0) 2(2.5,0)
CONN-TH_5P-P2.50_HC-XH-5A-G
  rect 1.524x1.524 hole 0.914: 1(-5,0)
  round 1.524 hole 0.914: 2(-2.499,-0.001) 3(0.001,-0.001) 4(2.501,-0.001) 5(5,-0.001)
CONN-TH_XH-2A
  round 1.8 hole 1.1: 1(-1.25,-0.001) 2(1.252,-0.001)
CONN-TH_XH-3A
  round 1.8 hole 1: 1(-2.5,0) 2(0,0) 3(2.5,0)
HDR-TH_5P-P2.54-V-M
  rect 1.7x1.7 hole 1.1: 1(-5.08,0)
  round 1.7 hole 1.1: 2(-2.54,0) 3(0,0) 4(2.54,0) 5(5.08,0)
HDR-TH_8P-P2.54-V-M
  rect 1.5x1.5 hole 1: 1(-8.89,0)
  round 1.5 hole 1: 2(-6.35,0) 3(-3.81,0) 4(-1.27,0) 5(1.27,0) 6(3.81,0) 7(6.35,0) 8(8.89,0)
Pad_e1511
  round 2 hole 3: 2(0,0)
R1206
  rect 1.208x1.701 smd: 1(-1.478,0) 2(1.478,0)
RES-ADJ-SMD_RM065-V1
  rect 2.2x2.1 hole 1: 1(-2.5,-2.5)
  round 2.2 hole 1: 2(0,2.5) 3(2.5,-2.5)
SINK-TH_L15.0-W10.5-H21.0
  round 2 hole 1.5: 1(0,0)
SMA_L4.3-W2.6-LS5.0-RD
  rect 2.046x1.62 smd: 1(-2.404,-0.009) 2(2.404,0.009)
SOIC-8_L4.9-W3.9-P1.27-LS6.0-BL
  oval 0.588x2.045 smd: 1(-1.905,-2.772) 2(-0.635,-2.772) 3(0.635,-2.772) 4(1.905,-2.772) 5(1.905,2.772) 6(0.635,2.772) 7(-0.635,2.772) 8(-1.905,2.772)
SOT-223-3_L6.4-W3.5-P2.30-LS7.0-BR
  rect 2.5x1.1 smd: 1(2.97,-2.3) 2(2.97,0) 3(2.97,2.3)
  rect 2.34x3.6 smd: 4(-2.97,0)
SSOP-28_L10.4-W5.6-P0.65-LS7.6-BL
  rect 0.45x1.905 smd: 1(-4.225,-3.7) 2(-3.575,-3.7) 3(-2.925,-3.7) 4(-2.275,-3.7) 5(-1.625,-3.7) 6(-0.975,-3.7) 7(-0.325,-3.7) 8(0.325,-3.7) 9(0.975,-3.7) 10(1.625,-3.7) 11(2.275,-3.7) 12(2.925,-3.7) 13(3.575,-3.7) 14(4.225,-3.7) 15(4.225,3.7) 16(3.575,3.7) 17(2.925,3.7) 18(2.275,3.7) 19(1.625,3.7) 20(0.975,3.7) 21(0.325,3.7) 22(-0.325,3.7) 23(-0.975,3.7) 24(-1.625,3.7) 25(-2.275,3.7) 26(-2.925,3.7) 27(-3.575,3.7) 28(-4.225,3.7)
TO-220-3_L10.0-W4.5-P2.54-L
  rect 1.8x2.6 hole 1.2: 1(-2.54,0.005)
  oval 1.8x2.6 hole 1.2: 2(0,0.005) 3(2.54,-0.005)
WIFIM-SMD_ESP32-WROOM-32D
  rect 0.95x2.1 smd: 1(-9.015,-8.999) 2(-7.745,-8.999) 3(-6.475,-8.999) 4(-5.205,-8.999) 5(-3.935,-8.999) 6(-2.665,-8.999) 7(-1.395,-8.999) 8(-0.125,-8.999) 9(1.145,-8.999) 10(2.415,-8.999) 11(3.685,-8.999) 12(4.955,-8.999) 13(6.225,-8.999) 14(7.495,-8.999) 25(7.495,9) 26(6.225,9) 27(4.955,9) 28(3.685,9) 29(2.415,9) 30(1.145,9) 31(-0.125,9) 32(-1.395,9) 33(-2.665,9) 34(-3.935,9) 35(-5.205,9) 36(-6.475,9) 37(-7.745,9) 38(-9.015,9)
  rect 2.1x0.95 smd: 15(9.015,-5.715) 16(9.015,-4.445) 17(9.015,-3.175) 18(9.015,-1.905) 19(9.015,-0.635) 20(9.014,0.635) 21(9.014,1.905) 22(9.014,3.175) 23(9.014,4.445) 24(9.014,5.715)
  rect 5x5 smd: 39(-1.045,-1.45)

## Nets
As in the schematic, except:
GND: C1.2 C2.2 C3.2 C4.2 C5.2 C6.1 C13.2 C16.2 C17.2 C18.1 C19.1 C21.2 C23.2 C24.2 C25.1 C27.2 C29.2 C30.2 C31.1 C32.1 C33.2 CHA.2 CHB.2 CHC.2 D2.2 D4.2 D6.2 D8.2 ENC.5 ESC.2 ESP-WROOM-32.38 ESP-WROOM-32.39 H1.7 H2.7 IR.2 NOREF.2 OUT.2 PROG.5 R1.3 R2.3 R5.3 R6.3 R12.2 R13.2 U1.2 U2.1 U3.1 U5.27 U8.2 U9.2

Pads without a net: ESP-WROOM-32 1 4 5 8 14 15 17 18 19 20 21 22 23 29 31 32; U2 4; U5 7 8 9 10 11 12 13 14 15 16 17 18 19 20 21; U11 1

## Via types
v1: diameter 0.61, hole 0.305, Top Layer to Bottom Layer, 31 vias

## Routing (per net, layer and track width the routed paths; a pad name or vN(x,y) marks a point on that pad's centre or on a via; arc(x,y) is an arc through that point)
+3V3: length 65.9
  Top Layer w0.5: 50.47,43.5 49.47,43.5 48.47,42.5 U2.2 ; 50.47,43.5 v1(50.47,42.5) ; 50.47,43.5 53.25,43.5 C4.1 57,47.25 72.02,47.25 ; v1(57,26) 68.52,26 72.02,22.5
  Bottom Layer w0.5: v1(57,26) 52.5,30.5 C19.2 50.47,30.53 v1(50.47,42.5)
+3V3D: length 117.8
  Top Layer w0.5: C33.1 23.22,40.97 20.5,40.97 ; U3.2 18.97,42.5 20.5,40.97 ; v1(46.5,26.5) 46.5,29 ; 46.5,29 47,29.5 47,33.02 46.52,33.5 ; 46.5,29 39.98,29 R16.1 R17.1 21.5,32.98 R9.1 20.5,34.98 20.5,40.97 ; 39.5,9.75 41.78,9.75 R19.1 44.5,15.48 v1(43,16.98)
  Bottom Layer w0.5: H2.8 4.11,10 C32.2 8.61,10.11 H1.8 19.87,16.98 v1(43,16.98) 43,17.98 46,20.98 ENC.1 46,26 v1(46.5,26.5)
+9V: length 34.8
  Top Layer w0.256: v1(44.78,74.01) 46.32,75.55 51.18,75.55 51.38,75.35 U5.24
  Bottom Layer w0.256: U1.3 28.24,66.5 C3.1 33.79,72.04 42.04,72.04 C18.2 44.27,73.5 v1(44.78,74.01)
GND: length 503.5
  Top Layer w0.254: 40.91,68.09 44.53,68.09 49.41,72.97 49.41,73.47
  Top Layer w0.45: 38,73.75 49,84.75 OUT.2
  Top Layer w0.5: 74.77,8.22 76.27,6.72 79.27,6.72 79.75,7.2 80.25,7.2 ; 74.77,8.22 74.77,9.93 ; 74.77,8.22 C29.2 ; C13.2 41,68.5 38.5,71 C18.1 38.25,73.75 C3.2 32.5,74.25 32.5,84.5 C16.2 C1.2 13.6,84.1 7.9,84.1 ; NOREF.2 7.9,84.1 ; 7.9,84.1 D4.2 5.9,80.51 5.9,78.51 D2.2 ; 45.47,40.2 44.97,39.7 44.97,31.03 C19.1 ; 45.47,40.2 U2.1 53.45,40.2 C4.2 56,39.75 ; 45.47,40.2 43.97,40.2 43.47,39.7 32.97,39.7 28.5,44.17 ; 56,39.75 61.5,39.75 R5.3 70,38.25 72.25,38.25 72.75,37.75 72.75,35.25 74.25,33.75 ; 56,39.75 C5.2 ENC.5 ; 88.91,23.61 88.91,21.09 R2.3 ; 88.91,23.61 89.18,23.61 C27.2 ; 88.91,23.61 83.41,23.61 ; ENC.5 58.7,25 R6.3 67,18.7 72.77,12.93 72.77,10.43 73.27,9.93 74.77,9.93 ; ENC.5 56,20.5 51.5,16 ; 74.77,9.93 76.27,9.93 78.77,12.43 78.77,13.34 U9.2 ; 89,48 86.5,48 86,47.5 C25.1 83.36,47.36 83.36,43.06 78.86,38.56 U8.2 78.63,37.75 78.63,36.75 75.63,33.75 74.25,33.75 ; 89,48 89,45.55 R1.3 ; 89,48 89.25,48 C21.2 ; H2.7 6.35,15 C32.1 10.85,12.65 H1.7 17.17,8.48 ESP-WROOM-32.38 26.74,8.48 31.92,13.67 ; 51.5,16 50,16 IR.2 ; 51.5,16 51.5,10.25 ESC.2 44.92,3.67 ; 16,59.5 C2.2 18.5,56.5 18.5,47.5 16.5,45.5 16.5,43.17 ; 16,59.5 21,64.5 ; 16,59.5 7.91,59.5 7.9,59.51 5.9,57.51 5.9,55.51 7.9,53.51 ; 31.92,13.67 31.92,16.43 ESP-WROOM-32.39 ; 31.92,13.67 41.92,3.67 44.92,3.67 ; U1.2 21,64.5 22,64.5 27.5,59 C17.2 40.5,69 ; 16.5,43.17 17,43.67 24,43.67 26.5,46.17 27.5,46.17 28.5,45.17 28.5,44.17 ; 16.5,43.17 16.5,41.67 17.97,40.2 ; 28.5,44.17 28.5,42.75 C33.2 ; 80.25,7.2 80.25,4.03 R13.2 ; 80.25,7.2 C30.2 ; 44.92,3.67 PROG.5 ; 17.97,40.2 U3.1 ; 17.97,40.2 17.97,38.97 C6.1 ; 83.41,23.61 83.41,25.11 80.02,28.5 80.25,28.73 80.25,31.75 ; 83.41,23.61 C31.1 ; 80.25,31.75 79.75,31.75 79.25,31.25 76.25,31.25 74.75,32.75 74.75,33.25 74.25,33.75 ; 80.25,31.75 C24.2 ; 49,85.75 49.5,85.25 62.25,85.25 CHC.2 65.5,85.5 74.5,85.5 CHB.2 77.5,85.5 86.5,85.5 CHA.2
BTNESC: length 22.8
  Top Layer w0.256: v1(41.07,23.18) 40.52,23.72 ESP-WROOM-32.13 ; 44.5,9.52 48.27,9.52 ESC.1 48.75,12.94 44.65,17.04 44.65,17.55 43.12,19.08 v1(42.86,19.08)
  Bottom Layer w0.256: v1(42.86,19.08) 42.86,21.39 v1(41.07,23.18)
ENCKEY: length 10.1
  Top Layer w0.256: 39.5,22.45 45.96,22.45 ENC.2
ENCS1: length 16.1
  Top Layer w0.256: v1(50.43,21.93) 48.42,19.91 ESP-WROOM-32.10
  Bottom Layer w0.256: ENC.4 v1(50.43,21.93)
ENCS2: length 13.1
  Top Layer w0.256: ESP-WROOM-32.11 47.19,21.19 ENC.3
IR: length 7.1
  Top Layer w0.256: v1(43.85,17.36) 42.83,18.39 39.76,18.39 ESP-WROOM-32.9
  Bottom Layer w0.256: v1(43.85,17.36) 45.86,17.36 IR.1
OUTF1: length 53.5
  Bottom Layer w0.256: OUT.3 C15.2 70,57 R5.1
OUTF2: length 78
  Bottom Layer w0.256: OUT.1 52,86.5 C14.2 51.06,79.56 51.06,78.09 71.54,57.61 71.54,41.74 70,40.21 R6.1
OUTLOGL: length 69
  Top Layer w0.256: R3.2 89.59,34.25 R3.1 87.04,34.3 81.5,34.3 ; 81.5,34.3 81.5,35.58 81.4,35.67 U8.4 ; 81.5,34.3 C24.1 v1(80.48,32.73) ; v1(42.61,16.1) ESP-WROOM-32.7
  Bottom Layer w0.256: v1(42.61,16.1) 70.25,16.1 71.52,17.37 71.52,23.77 v1(80.48,32.73)
OUTLOGR: length 59
  Top Layer w0.256: 81.5,10.26 86.94,10.26 R4.1 89.5,10.2 R4.2 ; 81.5,10.26 81.5,11.03 81.4,11.12 U9.4 81.4,13.94 80.51,14.83 v1(79.49,14.83) ; 81.5,10.26 C30.1 ; v1(43.39,14.83) 39.5,14.83
  Bottom Layer w0.256: v1(43.39,14.83) 43.9,15.35 78.97,15.35 v1(79.49,14.83)
$1N1: length 13.3
  Top Layer w0.256: 3.09,71.41 3.09,71.41 AC9V.1 ; 3.09,72.68 D1.2 3.09,76.49
  Top Layer w0.5: 5.5,69 3.09,69 3.09,71.41 ; 3.09,71.41 3.09,72.68
$1N2: length 40.5
  Top Layer w0.256: D4.1 D3.2 5.91,76.67 5.91,71.04 7.19,69.76 7.19,65.69 AC9V.2
  Top Layer w0.5: 3.09,79.49 1.99,79.49 1.5,79 1.5,66 3.5,64 AC9V.2
$1N4: length 41.2
  Top Layer w0.256: 8.89,79.51 D3.1 ; 8.89,79.51 9.4,79 9.4,75.41 8.38,74.39 ; 8.89,79.51 10.17,79.51 11.14,80.48 v1(14.98,80.48) ; 8.38,74.39 8.58,74.39 U1.1 ; 8.38,74.39 8,74.01 D1.1
  Bottom Layer w0.256: v1(14.98,80.48) C1.1 C16.1
$1N7: length 16.5
  Top Layer w0.256: v1(23.24,25.17) 23.44,25.17 ESP-WROOM-32.24
  Bottom Layer w0.256: v1(23.24,25.17) 13.26,15.19 H1.6
$1N8: length 19.5
  Top Layer w0.256: v1(19.52,22.45) 21.5,22.45
  Bottom Layer w0.256: H2.5 H1.5 14.79,17.73 v1(19.52,22.45)
$1N9: length 26.3
  Top Layer w0.256: ESP-WROOM-32.26 18.38,23.72 15.56,26.54 12.49,26.54 11.72,25.77 11.72,21.55 H1.4
  Bottom Layer w0.256: H1.4 H2.4
$1N10: length 26.1
  Top Layer w0.256: H1.3 19.91,15.9 19.91,10.52 20.68,9.75 21.5,9.75
  Bottom Layer w0.256: H1.3 H2.3
$1N11: length 20.3
  Top Layer w0.256: H1.2 19.7,18.64 ESP-WROOM-32.30
  Bottom Layer w0.256: H1.2 H2.2
$1N12: length 20.3
  Top Layer w0.256: v1(15.05,25.84) 19.7,21.19 ESP-WROOM-32.28
  Bottom Layer w0.256: v1(15.05,25.84) H1.1 H2.1
$1N13: length 80.3
  Top Layer w0.256: v1(29.6,23.37) 26.27,20.04 26.27,13.12 24.17,11.02 ESP-WROOM-32.36 ; v1(35.23,29) 35.23,29.25 36,30.02 ; U5.25 50.72,72.4 48.03,69.7 48.03,46.92 v1(50.59,44.36)
  Bottom Layer w0.256: v1(50.59,44.36) v1(35.23,29) v1(29.6,23.37)
$1N14: length 73.3
  Top Layer w0.256: v1(30.22,29.51) 30.99,29.51 31.5,30.02 ; U5.26 50.07,72.92 46.86,69.7 v1(46.86,46.15) ; v1(24.84,24.13) 24.84,17.22 22.54,14.92 21.58,14.92 21.5,14.83
  Bottom Layer w0.256: v1(46.86,46.15) v1(30.22,29.51) v1(24.84,24.13)
$1N15: length 54.2
  Top Layer w0.256: U5.1 48.78,68.03 49.95,69.21 54.82,69.21 60.96,75.35 90.15,75.35 U4.2
  Bottom Layer w0.256: U4.2 C7.2
$1N16: length 45.8
  Top Layer w0.256: U6.2 81.34,64.34 50.11,64.34 49.43,65.03 U5.2
  Bottom Layer w0.256: U6.2 C8.2
$1N17: length 38.1
  Top Layer w0.256: U5.3 50.07,65.26 50.48,64.86 75.36,64.86 U7.2
  Bottom Layer w0.256: U7.2 C9.2
$1N18: length 30.4
  Top Layer w0.256: U10.2 69.37,65.37 50.94,65.37 50.72,65.58 U5.4
  Bottom Layer w0.256: U10.2 C10.2
$1N19: length 25.3
  Top Layer w0.256: U5.5 51.38,68.21 51.86,68.7 55.19,68.7 61.33,74.84 64.66,74.84 U12.2
  Bottom Layer w0.256: U12.2 C11.2
$1N20: length 14.9
  Top Layer w0.256: U5.6 52.03,68.08 52.13,68.18 59.18,68.18 U13.2
  Bottom Layer w0.256: U13.2 C12.2
$1N22: length 9.5
  Top Layer w0.256: U5.28 44.57,70 C13.1
$1N24: length 8.7
  Bottom Layer w0.256: CHC.3 62,86.5 U13.1 C12.1
$1N25: length 9.3
  Bottom Layer w0.256: C11.1 U12.1 68.5,85 CHC.1
$1N26: length 9.1
  Bottom Layer w0.256: C10.1 U10.1 75,85.5 CHB.3
$1N27: length 9.7
  Bottom Layer w0.256: C9.1 U7.1 81.5,84 CHB.1
$1N28: length 9.5
  Bottom Layer w0.256: CHA.3 88,84.5 U6.1 C8.1
$1N29: length 10.1
  Bottom Layer w0.256: CHA.1 94.5,83 U4.1 C7.1
$1N32: length 20.4
  Top Layer w0.256: R11.1 50.98,32 51.75,32 ; 51.75,32 52.26,31.49 52.26,18.76 IR.3 ; 51.75,32 C5.1
$1N44: length 33
  Top Layer w0.256: U8.6 U8.7 78.86,47.14 C25.2 ; C25.2 80.29,49.29 90.02,49.29 90.5,48.81 90.5,47.53 92.04,46 92.04,40.59 R1.1 ; C25.2 75.23,47.5 R14.1
$1N46: length 4.9
  Top Layer w0.256: v1(82.43,43.27) 82.17,43.52 U8.5
  Bottom Layer w0.256: v1(82.43,43.27) 83.78,43.27 R1.2
$1N51: length 6.6
  Top Layer w0.256: 76.75,32.75 80.13,36.13 U8.3
$1N54: length 6.6
  Top Layer w0.256: U9.3 80.13,11.58 C29.1
$1N56: length 21.1
  Top Layer w0.256: R15.1 75.07,22.59 C31.2 78.86,22.14 78.86,18.97 80.13,18.97 80.13,18.46 83.97,14.62 90.38,14.62 R2.1
$1N60: length 4.9
  Top Layer w0.256: R2.2 83.53,18.97 81.4,18.97
$1N67: length 6.1
  Bottom Layer w0.256: C20.2 67.5,34.25 R5.2
$1N69: length 6.1
  Bottom Layer w0.256: C26.2 67.5,9.7 R6.2
$1N71: length 41.7
  Top Layer w0.256: H2.6 10.97,22.16 10.97,28.05 12,29.08 14.05,29.08 15.07,28.05 34.27,28.05 34.94,27.38 ESP-WROOM-32.16
$1N81: length 55
  Top Layer w0.256: v1(41.55,10.77) 41.29,11.02 ESP-WROOM-32.3 38.7,11.02 37.92,11.81 37.92,26.91 36.64,28.19 34.85,28.19 34.34,28.71 22.82,28.71 20,31.52 15.52,31.52 C6.2
  Bottom Layer w0.256: PROG.3 42.73,10.77 v1(41.55,10.77)
$1N82: length 38.2
  Top Layer w0.256: 21.5,24.99 21.51,25 22.37,25 23.14,24.24 23.4,24.24 24.16,25 29.03,25 36.71,17.32 v1(36.71,12.72)
  Bottom Layer w0.256: PROG.4 38.24,12.72 v1(36.71,12.72)
$1N83: length 38.6
  Top Layer w0.256: 21.5,12.29 23.43,12.29 v1(24.36,13.23)
  Bottom Layer w0.256: PROG.1 49.96,8.62 48.17,8.62 42.79,14 25.13,14 v1(24.36,13.23)
$1N84: length 35.8
  Top Layer w0.256: v1(25.4,13.23) 24.64,14 24.12,14 23.69,13.56 ESP-WROOM-32.34
  Bottom Layer w0.256: PROG.2 42.56,13.48 25.66,13.48 v1(25.4,13.23)
$1N85: length 65.6
  Top Layer w0.256: 8.88,56.51 9.91,56.51 11.39,55.02 v1(14.98,55.02) ; 8.88,56.51 7.9,56.51 ; 8.88,56.51 9.39,56 9.39,52 7.9,50.51 ; U2.3 36.77,54 C17.1 27.67,54 U3.3
  Bottom Layer w0.256: v1(14.98,55.02) C2.1 C17.1
$1N87: length 9.5
  Top Layer w0.256: 5.5,45 3.1,47.4 D5.2 D6.1
$1N88: length 21.9
  Top Layer w0.256: D8.1 D7.2 5.91,53.67 5.91,47.02 7.19,45.74 7.19,41.69 5.5,40
$1N99: length 4
  Top Layer w0.256: 71.52,36.5 71,35.98 C20.1
$1N100: length 11.6
  Top Layer w0.256: 74.52,43.78 75.29,43.01 75.29,37.31 R7.1 ; 74.52,43.78 74.78,43.78 75.03,43.52 U8.8 ; 74.52,43.78 74.01,43.78 C22.2
$1N101: length 8.3
  Top Layer w0.256: C21.1 94,45.75 R8.2
$1N102: length 27.1
  Top Layer w0.256: 94,38.02 93.44,37.47 82.97,37.47 v1(82.46,37.98) ; U8.1 v1(76.82,37.21) 75.54,35.93 75.54,35.42 75.3,35.17 73.74,35.17 73.49,35.43 73.49,38.2 C22.1
  Bottom Layer w0.256: v1(82.46,37.98) 81.69,37.21 v1(76.82,37.21)
$1N103: length 4
  Top Layer w0.256: 71.52,12 71,11.48 C26.1
$1N104: length 11.6
  Top Layer w0.256: 74.52,19.23 75.29,18.46 75.29,12.81 R10.1 ; 74.52,19.23 74.01,19.23 C28.2 ; 74.52,19.23 74.78,19.23 75.03,18.97 77.59,18.97
$1N105: length 8.4
  Top Layer w0.256: R18.2 94,21.26 C27.1
$1N106: length 28
  Top Layer w0.256: 94,13.52 93.49,13.01 84.85,13.01 82.29,15.57 79.22,15.57 77.59,13.94 U9.1 77.59,12.92 75.3,10.62 73.74,10.62 73.49,10.88 73.49,13.65 C28.1
$1N107: length 4.2
  Top Layer w0.256: R4.3 85.64,3.84 R13.1
$1N111: length 8.1
  Top Layer w0.256: C15.1 49,78.5 52.03,75.48 U5.23
$1N112: length 4.6
  Top Layer w0.256: U5.22 52.68,77.82 C14.1
$1N2022: length 4.4
  Top Layer w0.256: R3.3 86.34,28.5 R12.1

## Copper pours and planes (outline as drawn; the poured copper is in the pictures)
GND on Bottom Layer: 0.5,91.5 99.25,91.5 99.5,0.5 0.5,0.5

## Text on the board
Top Silkscreen Layer: GND | BOOT | RST | RX | TX
